# Altium project PowerTower_AdapterUltrazohm.PrjPcb (part 1 of 2)
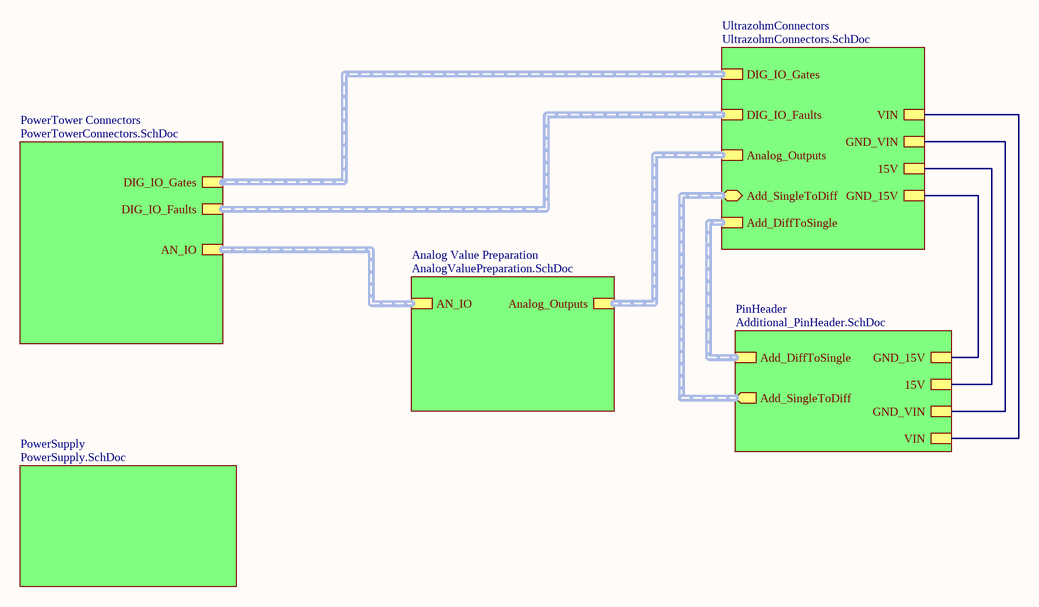
[diagram p0: TopSheet.SchDoc]
8 sheets, 131 parts. Net scope: hierarchical (ports join the sheet entries above them; power ports are global).
Board file: PowerTowerAdapterUltraZohm.PcbDoc
Sheets:
  TopSheet.SchDoc
    PowerTower Connectors = PowerTowerConnectors.SchDoc
    PowerSupply = PowerSupply.SchDoc
    UltrazohmConnectors = UltrazohmConnectors.SchDoc
      Differential to Single = DifferentialToSingle.SchDoc
      Single To RS422 = SingleToDifferential.SchDoc
    Analog Value Preparation = AnalogValuePreparation.SchDoc
    PinHeader = Additional_PinHeader.SchDoc

## Sheet TopSheet.SchDoc
size A4; Author: Timo Wilfling; Address1: TH Nürnberg; Address2: Georg Simon Ohm; Address3: Kesslerplatz 10; Address4: 90489 Nürnberg; SheetNumber: 1; SheetTotal: 8

### Sub-sheets
Analog Value Preparation = AnalogValuePreparation.SchDoc: AN_IO (harness Analog_Connector), Analog_Outputs (harness Analog Outputs)
PinHeader = Additional_PinHeader.SchDoc: Add_SingleToDiff (out, harness Add_SingleToDiff), Add_DiffToSingle (harness Add_DiffToSingle), GND_15V, 15V, GND_VIN, VIN
PowerSupply = PowerSupply.SchDoc: no entries
PowerTower Connectors = PowerTowerConnectors.SchDoc: DIG_IO_Gates (harness DigCon_DIG_IO_Gates), AN_IO (harness Analog_Connector), DIG_IO_Faults (harness DigCon_DIG_IO_Faults)
UltrazohmConnectors = UltrazohmConnectors.SchDoc: DIG_IO_Gates (harness DigCon_DIG_IO_Gates), Analog_Outputs (harness Analog Outputs), DIG_IO_Faults (harness DigCon_DIG_IO_Faults), Add_SingleToDiff (bidir, harness Add_SingleToDiff), VIN, GND_VIN, 15V, GND_15V, Add_DiffToSingle (harness Add_DiffToSingle)

### Nets
NetX8_1: sheet UltrazohmConnectors/VIN, sheet PinHeader/VIN
NetX8_10: sheet UltrazohmConnectors/15V, sheet PinHeader/15V
NetX8_16: sheet UltrazohmConnectors/GND_VIN, sheet PinHeader/GND_VIN
NetX8_25: sheet UltrazohmConnectors/GND_15V, sheet PinHeader/GND_15V

### Buses and harness runs
harness sheet Analog Value Preparation/AN_IO = sheet PowerTower Connectors/AN_IO
harness sheet Analog Value Preparation/Analog_Outputs = sheet UltrazohmConnectors/Analog_Outputs
harness sheet PinHeader/Add_DiffToSingle = sheet UltrazohmConnectors/Add_DiffToSingle
harness sheet PinHeader/Add_SingleToDiff = sheet UltrazohmConnectors/Add_SingleToDiff
harness sheet PowerTower Connectors/DIG_IO_Faults = sheet UltrazohmConnectors/DIG_IO_Faults
harness sheet PowerTower Connectors/DIG_IO_Gates = sheet UltrazohmConnectors/DIG_IO_Gates

### Notes on the sheet
- Title
- Size:
- Date:
- A4
- Revision:
- Time:
- Sheet
- of
- Author:
- Project:

## Sheet PowerTowerConnectors.SchDoc
size A4; Author: Timo Wilfling; Address1: TH Nürnberg; Address2: Georg Simon Ohm; Address3: Kesslerplatz 10; Address4: 90489 Nürnberg; SheetNumber: 3; SheetTotal: 8
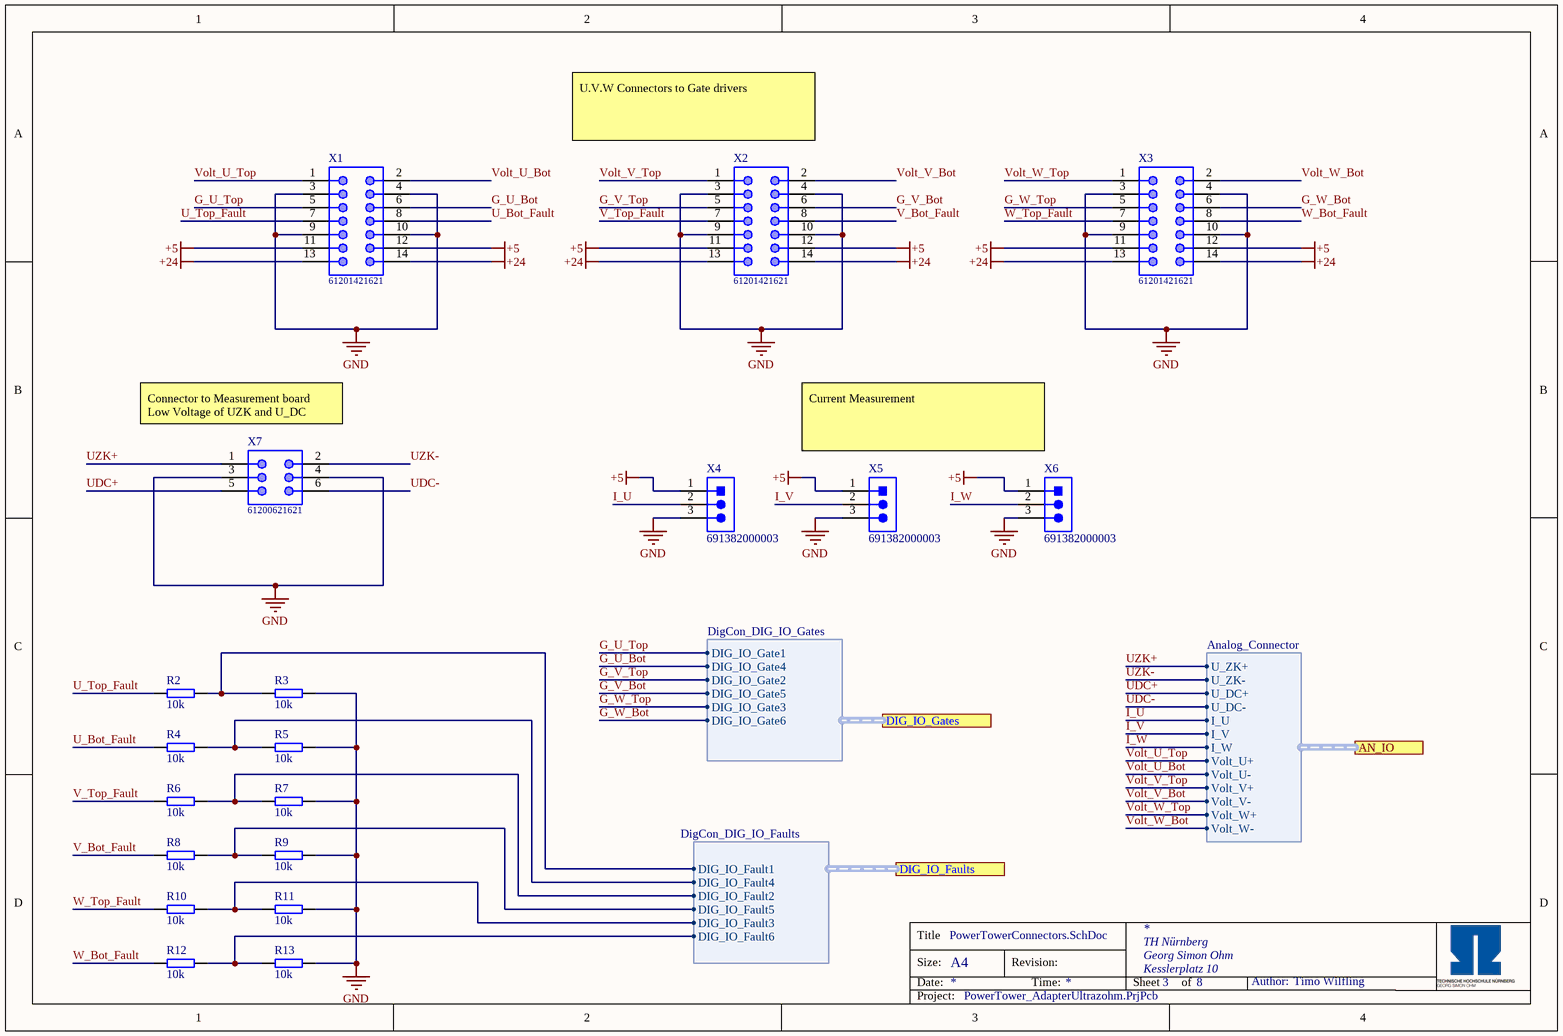
[diagram p1: PowerTowerConnectors.SchDoc]

### Parts
R2  10k  [RES 0603_1608]
R3  10k  [RES 0603_1608]
R4  10k  [RES 0603_1608]
R5  10k  [RES 0603_1608]
R6  10k  [RES 0603_1608]
R7  10k  [RES 0603_1608]
R8  10k  [RES 0603_1608]
R9  10k  [RES 0603_1608]
R10  10k  [RES 0603_1608]
R11  10k  [RES 0603_1608]
R12  10k  [RES 0603_1608]
R13  10k  [RES 0603_1608]
X1  61201421621  [61201421621]
X2  61201421621  [61201421621]
X3  61201421621  [61201421621]
X4  691382000003  [691382000003]
X5  691382000003  [691382000003]
X6  691382000003  [691382000003]
X7  61200621621  [61200621621]

### Ports
AN_IO (harness Analog_Connector), DIG_IO_Faults (harness DigCon_DIG_IO_Faults), DIG_IO_Gates (harness DigCon_DIG_IO_Gates)

### Harnesses
DigCon_DIG_IO_Gates: DIG_IO_Gate1, DIG_IO_Gate4, DIG_IO_Gate2, DIG_IO_Gate5, DIG_IO_Gate3, DIG_IO_Gate6
Analog_Connector: U_ZK+, U_ZK-, U_DC+, U_DC-, I_V, I_U, I_W, Volt_U+, Volt_U-, Volt_V-, Volt_V+, Volt_W+, Volt_W-
DigCon_DIG_IO_Faults: DIG_IO_Fault1, DIG_IO_Fault4, DIG_IO_Fault2, DIG_IO_Fault5, DIG_IO_Fault3, DIG_IO_Fault6

### Nets
+5: X1.11 X1.12 X2.11 X2.12 X3.11 X3.12 X4.1 X5.1 X6.1  [project net 5V]
+24: X1.13 X1.14 X2.13 X2.14 X3.13 X3.14  [project net 24V]
GND: R3.2 R5.2 R7.2 R9.2 R11.2 R13.2 X1.3 X1.4 X1.9 X1.10 X2.3 X2.4 X2.9 X2.10 X3.3 X3.4 X3.9 X3.10 X4.3 X5.3 X6.3 X7.3 X7.4
G_U_Bot: X1.6 ; port DIG_IO_Gates.DIG_IO_Gate4  [project net G4]
G_U_Top: X1.5 ; port DIG_IO_Gates.DIG_IO_Gate1  [project net G1]
G_V_Bot: X2.6 ; port DIG_IO_Gates.DIG_IO_Gate5  [project net G5]
G_V_Top: X2.5 ; port DIG_IO_Gates.DIG_IO_Gate2  [project net G2]
G_W_Bot: X3.6 ; port DIG_IO_Gates.DIG_IO_Gate6  [project net G6]
G_W_Top: X3.5 ; port DIG_IO_Gates.DIG_IO_Gate3  [project net G3]
I_U: X4.2 ; port AN_IO.I_U
I_V: X5.2 ; port AN_IO.I_V
I_W: X6.2 ; port AN_IO.I_W
U_Bot_Fault: R4.1 X1.8
U_Top_Fault: R2.1 X1.7
UDC+: X7.5 ; port AN_IO.U_DC+
UDC-: X7.6 ; port AN_IO.U_DC-
UZK+: X7.1 ; port AN_IO.U_ZK+
UZK-: X7.2 ; port AN_IO.U_ZK-
V_Bot_Fault: R8.1 X2.8
V_Top_Fault: R6.1 X2.7
Volt_U_Bot: X1.2 ; port AN_IO.Volt_U-
Volt_U_Top: X1.1 ; port AN_IO.Volt_U+
Volt_V_Bot: X2.2 ; port AN_IO.Volt_V-
Volt_V_Top: X2.1 ; port AN_IO.Volt_V+
Volt_W_Bot: X3.2 ; port AN_IO.Volt_W-
Volt_W_Top: X3.1 ; port AN_IO.Volt_W+
W_Bot_Fault: R12.1 X3.8
W_Top_Fault: R10.1 X3.7
NetR2_2: R2.2 R3.1 ; port DIG_IO_Faults.DIG_IO_Fault1
NetR4_2: R4.2 R5.1 ; port DIG_IO_Faults.DIG_IO_Fault4
NetR6_2: R6.2 R7.1 ; port DIG_IO_Faults.DIG_IO_Fault2
NetR8_2: R8.2 R9.1 ; port DIG_IO_Faults.DIG_IO_Fault5
NetR10_2: R10.2 R11.1 ; port DIG_IO_Faults.DIG_IO_Fault3
NetR12_2: R12.2 R13.1 ; port DIG_IO_Faults.DIG_IO_Fault6

### Notes on the sheet
- (near X2) U.V.W Connectors to Gate drivers
- (near X7) Connector to Measurement board
  Low Voltage of UZK and U_DC
- Current Measurement
- Title
- Size:
- Date:
- A4
- Revision:
- Time:
- Sheet
- of
- Author:
- Project:

### Library data of the parts
R2-R13 = RK73B1JTTD103J: SMD resistor E24 series; Manufacturer: KOA Speer; Tolerance: 5%; Created from: MGremer; Manufacturer Part Number: RK73B1JTTD103J; PartID: 98; Created On: 14.12.2020 16:17:14; ComponentLink1Description: Datasheet; ComponentLink1URL: https://www.mouser.de/datasheet/2/219/RK73B-1825463.pdf; Component Type: SMD resistor; Device Package: 0603; Last Updated: 02.03.2021 14:07:32; Mounting Type: SMD; Supplier 1: Mouser; Supplier Part Number 1: 660-RK73B1JTTD103J; Type: Resistor; Value: 10k; Live Cycle Status: 1; Stock number: Labor SMD Container
X1-X3 = 61201421621: 2.54mm Double Row 14-pol Vertical Male Pin Box Header; Manufacturer: Wurth; Created from: TWilfling; Number of positions: 14; Manufacturer Part Number: 61201421621; PartID: 45; Created On: 29.04.2021 14:12:30; ComponentLink1Description: Homepage; ComponentLink1URL: https://www.we-online.de/katalog/de/BHD_2_54_MALE_BOX_HEADER_6120XX21621?sq=61201421621#61201421621; ComponentLink2Description: Datasheet; ComponentLink2URL: https://www.we-online.de/katalog/datasheet/61201421621.pdf; Component Type: Wurth Connector; Device Package: Connector; Last Updated: 29.04.2021 14:52:34; Mounting Type: THT; Supplier 1: Wurth; Supplier Part Number 1: 61201421621; Type: Connector; Live Cycle Status: 1; Number of rows: 2; Stock number: not stored
X4-X6 = 691382000003: 2.5mm Single Row 3-pol Vertical PCB Header; Manufacturer: Wurth; Created from: TWilfling; Number of positions: 3; Manufacturer Part Number: 691382000003; PartID: 47; Created On: 29.04.2021 14:24:57; ComponentLink1Description: Homepage; ComponentLink1URL: https://www.we-online.de/katalog/de/TBL_2_50_382_VERTICAL_PCB_HEADER_69138200000X?sq=691382000003#691382000003; ComponentLink2Description: Datasheet; ComponentLink2URL: https://www.we-online.de/katalog/datasheet/691382000003.pdf; Component Type: Wurth Connector; Device Package: Connector; Last Updated: 29.04.2021 14:52:34; Mounting Type: THT; Supplier 1: Wurth; Supplier Part Number 1: 691382000003; Type: Connector; Live Cycle Status: 1; Number of rows: 1; Stock number: not stored
X7 = 61200621621: 2.54mm Double Row 6-pol Vertical Male Pin Box Header; Manufacturer: Wurth; Created from: TWilfling; Number of positions: 6; Manufacturer Part Number: 61200621621; PartID: 44; Created On: 29.04.2021 13:51:54; ComponentLink1Description: Homepage; ComponentLink1URL: https://www.we-online.de/katalog/de/BHD_2_54_MALE_BOX_HEADER_6120XX21621?sq=61200621621#61200621621; ComponentLink2Description: Datasheet; ComponentLink2URL: https://www.we-online.de/katalog/datasheet/61200621621.pdf; Component Type: Wurth Connector; Device Package: Connector; Last Updated: 29.04.2021 14:52:34; Mounting Type: THT; Supplier 1: Wurth; Supplier Part Number 1: 61200621621; Type: Connector; Live Cycle Status: 1; Number of rows: 2; Stock number: not stored

## Sheet PowerSupply.SchDoc
size A4; Author: Timo Wilfling; Address1: TH Nürnberg; Address2: Georg Simon Ohm; Address3: Kesslerplatz 10; Address4: 90489 Nürnberg; SheetNumber: 2; SheetTotal: 8
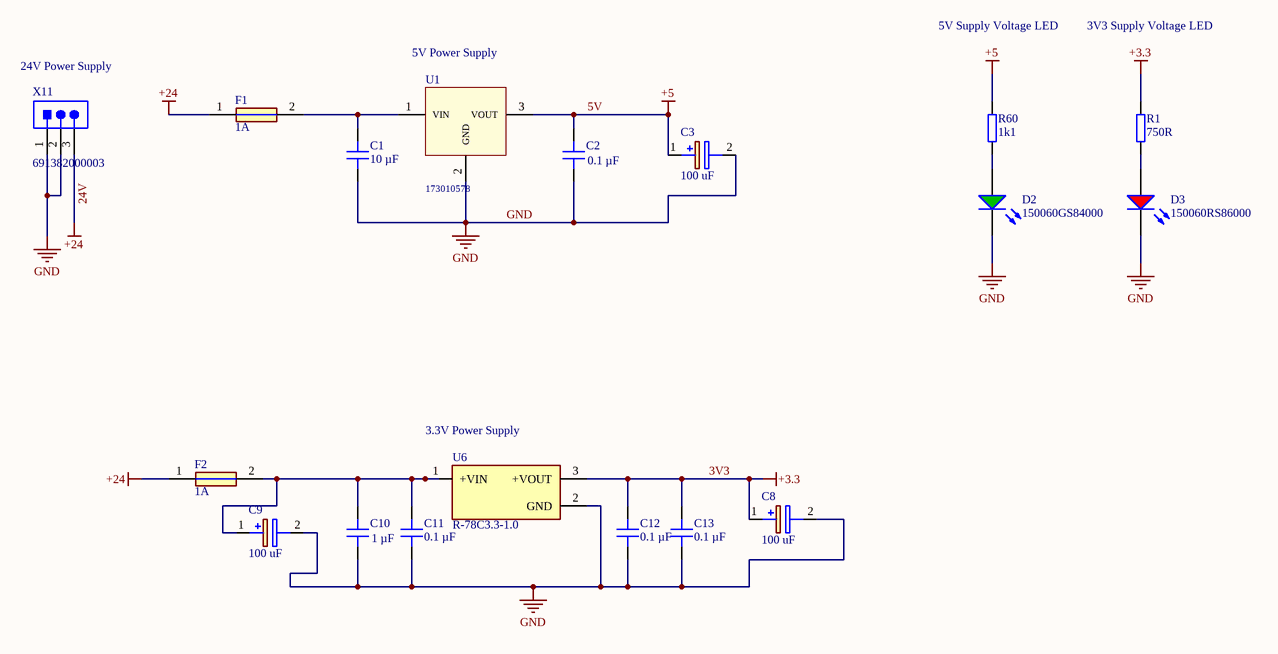
[diagram p2: PowerSupply.SchDoc]

### Parts
C1  10 µF  [C_0805]
C2  0.1 µF  [C_0603]
C3  100 uF  [CAPAE660X610N]
C8  100 uF  [CAPAE1270X1400N]
C9  100 uF  [CAPAE1270X1400N]
C10  1 µF  [C_0603]
C11  0.1 µF  [C_0603]
C12  0.1 µF  [C_0603]
C13  0.1 µF  [C_0603]
D2  150060GS84000  [WL-SMCW_0603]
D3  150060RS86000  [WL-SMCW_0603]
F1  1A  [Littlefuse_154]
F2  1A  [Littlefuse_154]
R1  750R  [RES 0603_1608]
R60  1k1  [RES 0603_1608]
U1  173010578  [FDSM_SIP-3]
U6  R-78C3.3-1.0  [CONV_R-78C3.3-1.0]
X11  691382000003  [691382000003]

### Nets
3V3: C8.1(+) C12.2 C13.2 R1.2 U6.3(+VOUT)  [also labelled +3.3]
5V: C2.2 C3.1(+) R60.2 U1.3(VOUT)  [also labelled +5]
24V: F1.1 F2.1 X11.3  [also labelled +24]
GND: C1.1 C2.1 C3.2(-) C8.2(-) C9.2(-) C10.1 C11.1 C12.1 C13.1 D2.1(K) D3.1(K) U1.2(GND) U6.2(GND) X11.1 X11.2
NetC1_2: C1.2 F1.2 U1.1(VIN)
NetC9_1: C9.1(+) C10.2 C11.2 F2.2 U6.1(+VIN)
NetD2_2: D2.2(A) R60.1
NetD3_2: D3.2(A) R1.1

### Notes on the sheet
- 24V Power Supply
- 5V Power Supply
- 5V Supply Voltage LED
- 3V3 Supply Voltage LED
- (near U6) 3.3V Power Supply
- Title
- Size:
- Date:
- A4
- Revision:
- Time:
- Sheet
- of
- Author:
- Project:

### Library data of the parts
C1 = GRM219R61E106KA12D: Capacitor 0805, 25 VDC, 10 µF, X5R; Manufacturer: muRata; Tolerance: 10 %; Voltage Rating: 25 VDC; Created from: MGremer; Manufacturer Part Number: GRM219R61E106KA12D; PartID: 13; Created On: 20.12.2020 13:54:13; ComponentLink1Description: Datasheet; ComponentLink1URL: https://www.mouser.de/datasheet/2/281/murata_03052018_GRM_Series_1-1310166.pdf; Component Type: Capacitor 0805; Device Package: 0805; Last Updated: 20.12.2020 16:34:30; Mounting Type: SMD; Operating Temperature: -55 - 85°C; Series: GRM; Supplier 1: Mouser; Supplier Part Number 1: 81-GRM219R61E106KA2D; Type: Capacitor; Value: 10 µF; Live Cycle Status: 1; Stock number: Labor SMD Container
C2 = C0603C104J3REC7411: Capacitor 0603, 25 VDC, 0.1 µF, X7R; Manufacturer: KEMET; Tolerance: 5 %; Voltage Rating: 25 VDC; Created from: MGremer; Manufacturer Part Number: C0603C104J3REC7411; PartID: 2; Created On: 20.12.2020 13:54:13; ComponentLink1Description: Datasheet; ComponentLink1URL: https://www.mouser.de/datasheet/2/212/1/KEM_C1090_X7R_ESD-1103328.pdf; Component Type: Capacitor 0603; Device Package: 0603; Last Updated: 20.12.2020 16:43:29; Mounting Type: SMD; Operating Temperature: -55 - 125°C; Series: ESD SMD Auto X7R; Supplier 1: Mouser; Supplier Part Number 1: 80-C0603C104J3RE7411; Type: Capacitor; Value: 0.1 µF; Live Cycle Status: 1; Stock number: Labor SMD Container
C3 = EEE-FK0J101V: Capacitor EEE, 6.3VDC, 100uF; Manufacturer: Panasonic; Tolerance: 20%; Created from: TWilfling; Manufacturer Part Number: EEE-FK0J101V; PartID: 71; Created On: 28.05.2021 17:07:38; ComponentLink1Description: Datasheet; ComponentLink1URL: https://www.mouser.de/datasheet/2/315/ABA0000C1181-947564.pdf; Component Type: Capacitor Al Electrolyt; Device Package: EEE; Last Updated: 28.05.2021 17:48:36; Mounting Type: SMD; Operating Temperature: -55 - 105°C; Series: FK-V; Supplier 1: Mouser; Supplier Part Number 1: 667-EEE-FK0J101V; Type: Capacitor; Voltage Rating: 6.3 VDC; Value: 100 uF; Live Cycle Status: 1; Stock number: not stored
C8 C9 = MAL216099101E3: Capacitor Al Electrolyt, 100 uF, 50VDC; Manufacturer: Vishay; Tolerance: 20%; Created from: TWilfling; Manufacturer Part Number: MAL216099101E3; PartID: 72; Created On: 28.05.2021 17:32:00; ComponentLink1Description: Datasheet; ComponentLink1URL: https://www.mouser.de/datasheet/2/427/160cla-1762101.pdf; Component Type: Capacitor Al Electrolyt; Last Updated: 28.05.2021 17:47:40; Mounting Type: SMD; Operating Temperature: -55 - 150°C; Series: 160 CLA; Supplier 1: Mouser; Supplier Part Number 1: 594-MAL216099101E3; Type: Capacitor; Voltage Rating: 50 VDC; Value: 100 uF; Live Cycle Status: 1; Stock number: not stored
C10 = UMK107AB7105KA-T: Capacitor 0603, 50 VDC, 1 µF, X7R; Manufacturer: Taiyo Yuden; Tolerance: 10 %; Voltage Rating: 50 VDC; Created from: MGremer; Manufacturer Part Number: UMK107AB7105KA-T; PartID: 5; Created On: 20.12.2020 13:54:13; ComponentLink1Description: Datasheet; ComponentLink1URL: https://www.mouser.de/datasheet/2/396/mlcc02_e-1307760.pdf; Component Type: Capacitor 0603; Device Package: 0603; Last Updated: 20.12.2020 16:42:28; Mounting Type: SMD; Operating Temperature: -55 - 125°C; Series: M; Supplier 1: Mouser; Supplier Part Number 1: 963-UMK107AB7105KA-T; Type: Capacitor; Value: 1 µF; Live Cycle Status: 1; Stock number: Labor SMD Container
C11-C13 = C0603X104K5RAC7411: Capacitor 0603, 50 VDC, 0.1 µF, X7R; Manufacturer: KEMET; Tolerance: 10 %; Voltage Rating: 50 VDC; Created from: MGremer; Manufacturer Part Number: C0603X104K5RAC7411; PartID: 3; Created On: 20.12.2020 13:54:13; ComponentLink1Description: Datasheet; ComponentLink1URL: https://www.mouser.de/datasheet/2/212/1/KEM_C1013_X7R_FT_CAP_SMD-1103280.pdf; Component Type: Capacitor 0603; Device Package: 0603; Last Updated: 04.03.2021 09:24:28; Mounting Type: SMD; Operating Temperature: -55 - 125°C; Series: SMD Comm X7R Flex; Supplier 1: Mouser; Supplier Part Number 1: 80-C0603X104K5R7411; Supplier 2: LCSC; Supplier Part Number 2: C14663; Type: Capacitor; Value: 0.1 µF; Live Cycle Status: 1; LCSC Part Number: C14663; Stock number: Labor SMD Container
D2 = 150060GS84000: WL-SMCW SMD Mono-color Chip LED Waterclear Green; Manufacturer: Wuerth Elektronik; Type: Standard; Created from: MGremer; Forward Current I_f: 20 mA; Forward Voltage U_f: 3.2 V; Wavelength: 525 nm; Light Intensity: 3000 mcd; Nominal Power: 78 mW; Manufacturer Part Number: 150060GS84000; PartID: 2; Created On: 08.12.2020 10:41:11; ComponentLink1Description: Datasheet; ComponentLink1URL: https://www.mouser.de/datasheet/2/445/150060GS75020-1714345.pdf; Component Type: LED Diode; Device Package: 0603; Last Updated: 03.03.2021 09:59:51; Mounting Type: SMD; Operating Temperature: -40 - 85 °C; Supplier 1: Mouser; Supplier Part Number 1: 710-150060GS84000; Supplier 2: Farnell; Supplier Part Number 2: 3408612; Supplier 3: Digi-Key; Supplier Part Number 3: 732-150060GS84000CT-ND; Live Cycle Status: 1; Stock number: not stored; Color: green
D3 = 150060RS86000: WL-SMCW SMD Mono-color Chip LED Waterclear Red; Manufacturer: Wuerth Elektronik; Type: Standard; Created from: MGremer; Forward Current I_f: 20 mA; Forward Voltage U_f: 2 V; Wavelength: 624 nm; Light Intensity: 800 mcd; Nominal Power: 48 mW; Manufacturer Part Number: 150060RS86000; PartID: 3; Created On: 08.12.2020 10:48:12; ComponentLink1Description: Datasheet; ComponentLink1URL: https://www.mouser.de/datasheet/2/445/150120RS75000-1714636.pdf; Component Type: LED Diode; Device Package: 0603; Last Updated: 03.03.2021 09:59:52; Mounting Type: SMD; Operating Temperature: -40 - 85 °C; Supplier 1: Mouser; Supplier Part Number 1: 710-150060RS86000; Supplier 2: Farnell; Supplier Part Number 2: 3408608; Supplier 3: Digi-Key; Supplier Part Number 3: 732-150060RS86000CT-ND; Live Cycle Status: 1; Stock number: not stored; Color: red
F1 F2 = 0154001.DR: Duse OMNI BLOK 154; Manufacturer: Littelfuse; Type: Fuse; Nominal voltage AC: 125 VAC; Nominal voltage DC: 125 VDC; Resistance: 78 mOhm; Created from: TWilfling; Manufacturer Part Number: 0154001.DR; PartID: 4; Created On: 07.05.2021 06:50:33; ComponentLink1Description: Datasheet; ComponentLink1URL: https://www.mouser.de/datasheet/2/240/Littelfuse_Fuse_154_154T_154L_154TL_Datasheet_pdf-365375.pdf; Component Type: NAN02 - 154 OMNI-BLOK; Device Package: OMNI-BLOK; Last Updated: 11.05.2021 11:17:19; Mounting Type: SMD; Operating Temperature: -55 - 125 °C; Series: 154; Supplier 1: Mouser; Supplier Part Number 1: 576-0154001.DR; Nominal current: 1 A; Value: 1 A; Live Cycle Status: 1; Stock number: not stored
R1 = RK73B1JTTDD751J: SMD resistor E24 series; Manufacturer: KOA Speer; Tolerance: 5%; Created from: MGremer; Manufacturer Part Number: RK73B1JTTDD751J; PartID: 71; Created On: 14.12.2020 16:17:14; ComponentLink1Description: Datasheet; ComponentLink1URL: https://www.mouser.de/datasheet/2/219/RK73B-1825463.pdf; Component Type: SMD resistor; Device Package: 0603; Last Updated: 02.03.2021 14:07:32; Mounting Type: SMD; Supplier 1: Mouser; Supplier Part Number 1: 660-RK73B1JTTDD751J; Type: Resistor; Value: 750R; Live Cycle Status: 1; Stock number: Labor SMD Container
R60 = RK73B1JTTDD112J: SMD resistor E24 series; Manufacturer: KOA Speer; Tolerance: 5%; Created from: MGremer; Manufacturer Part Number: RK73B1JTTDD112J; PartID: 75; Created On: 14.12.2020 16:17:14; ComponentLink1Description: Datasheet; ComponentLink1URL: https://www.mouser.de/datasheet/2/219/RK73B-1825463.pdf; Component Type: SMD resistor; Device Package: 0603; Last Updated: 02.03.2021 14:07:32; Mounting Type: SMD; Supplier 1: Mouser; Supplier Part Number 1: 660-RK73B1JTTDD112J; Type: Resistor; Value: 1k1; Live Cycle Status: 1; Stock number: Labor SMD Container
U1 = 173010578: Not isolated DCDC Converter 5 V Output, 1 A, 8 - 28 V Input; Manufacturer: Wuerth Elektronik; Value: 5 W; Created from: MGremer; Manufacturer Part Number: 173010578; PartID: 11; Created On: 06.01.2021 09:48:37; ComponentLink1Description: Datasheet; ComponentLink1URL: https://www.mouser.de/datasheet/2/445/173010578-1716125.pdf; Component Type: Not isolated DCDC Converter; Device Package: FDSM; Last Updated: 06.05.2021 06:17:55; Mounting Type: THT; Series: MagI3C-FDSM; Supplier 1: Mouser; Supplier Part Number 1: 710-173010578; Type: not isolated DCDC converter; Live Cycle Status: 1; Stock number: not stored
U6 = R-78C3.3-1.0: Not isolated DCDC Converter 3V3 Output, 1A, 7 - 42V Input; Manufacturer: RECOM; Value: 3V3@1A; Created from: TWilfling; Manufacturer Part Number: R-78C3.3-1.0; PartID: 15; Created On: 10.05.2021 11:04:05; ComponentLink1Description: Datasheet; ComponentLink1URL: https://docs.rs-online.com/9d1a/0900766b8135f258.pdf; Component Type: Not isolated DCDC Convert; Device Package: SIP-3; Last Updated: 11.05.2021 09:24:43; Mounting Type: THT; Operating Temperature: -40 - 85°C; Series: R-78C-1.0; Supplier 1: RS; Supplier Part Number 1: 739-8297; Type: not isolated DCDC converter; Live Cycle Status: 1; Stock number: not stored
X11 = 691382000003: as X4 on sheet PowerTowerConnectors; Manufacturer Part Number: 691382000003; PartID: 47; Created On: 29.04.2021 14:24:57; ComponentLink1Description: Homepage; ComponentLink1URL: https://www.we-online.de/katalog/de/TBL_2_50_382_VERTICAL_PCB_HEADER_69138200000X?sq=691382000003#691382000003; ComponentLink2Description: Datasheet; ComponentLink2URL: https://www.we-online.de/katalog/datasheet/691382000003.pdf; Component Type: Wurth Connector; Device Package: Connector; Last Updated: 29.04.2021 14:52:34; Mounting Type: THT; Supplier 1: Wurth; Supplier Part Number 1: 691382000003; Type: Connector; Live Cycle Status: 1; Number of rows: 1; Stock number: not stored

## Sheet UltrazohmConnectors.SchDoc
size A4; Author: Timo Wilfling; Address1: TH Nürnberg; Address2: Georg Simon Ohm; Address3: Kesslerplatz 10; Address4: 90489 Nürnberg; SheetNumber: 4; SheetTotal: 8
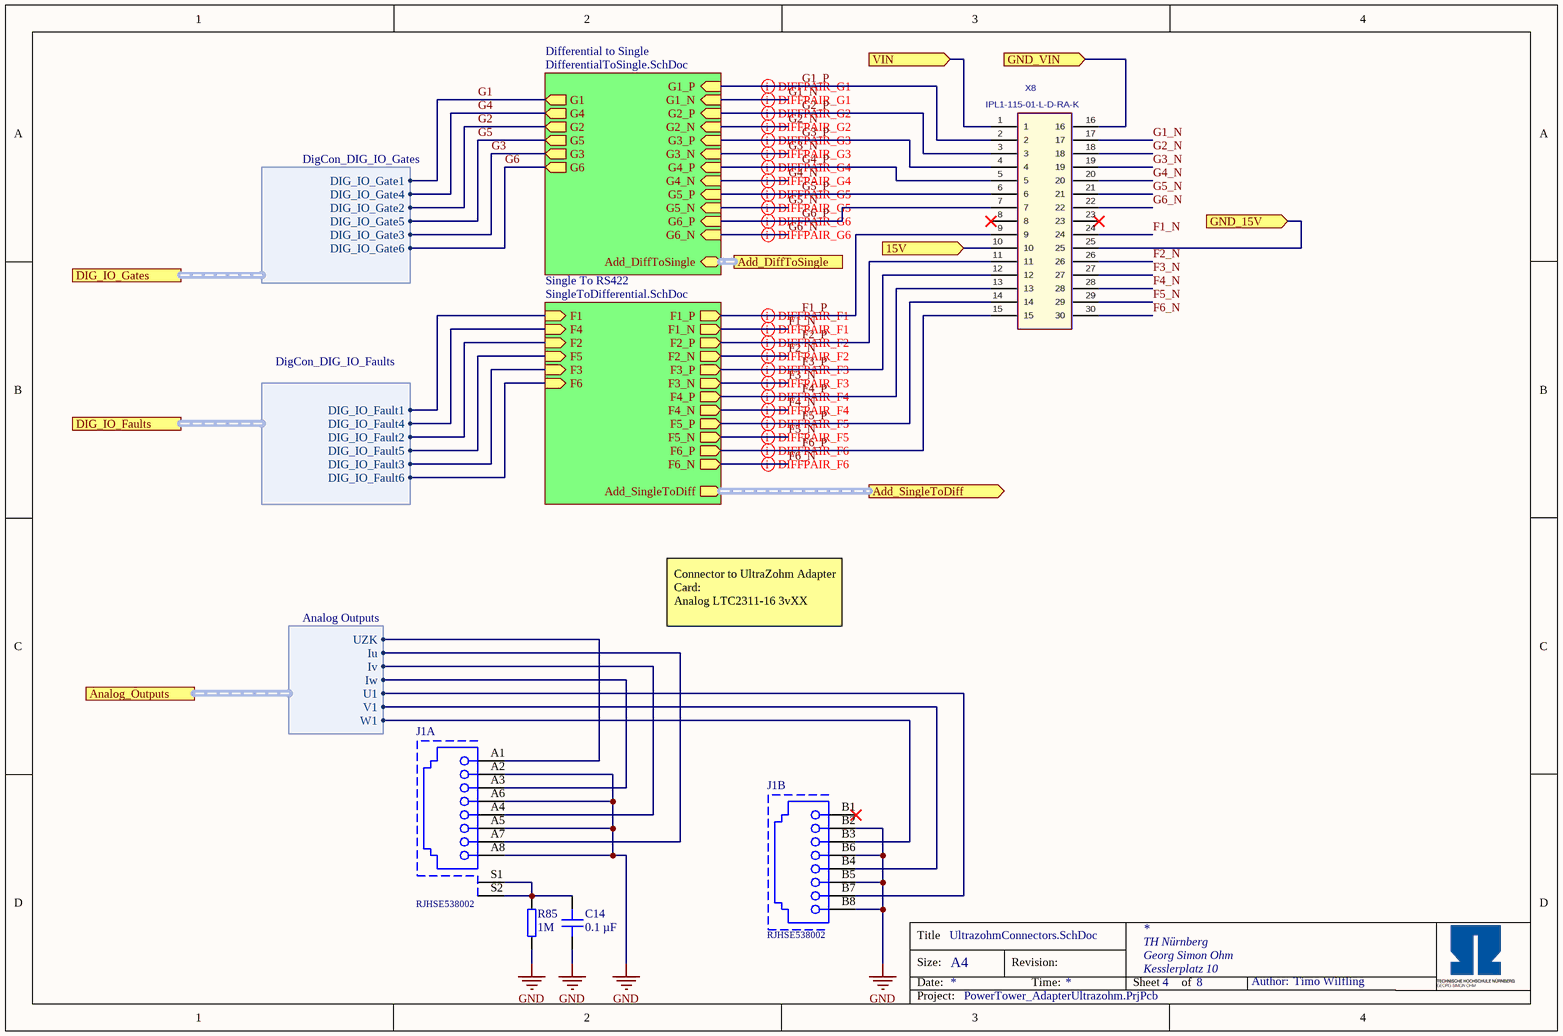
[diagram p3: UltrazohmConnectors.SchDoc]

### Parts
C14  0.1 µF  [C_0805]
J1  RJHSE538002  [RJHSE-5380-02]  (parts A,B of 2)
R85  1M  [RES 0603_1608]
X8  IPL1-115-01-L-D-RA-K  [IPL1-115-01-XX-D-RA]

### Sub-sheets
Differential to Single = DifferentialToSingle.SchDoc: G1 (out), G4 (out), G2 (out), G5 (out), G3 (out), G6 (out), G1_N (in), G2_P (in), G2_N (in), G3_P (in), G3_N (in), G4_P (in), G4_N (in), G1_P (in), G5_P (in), G5_N (in), G6_P (in), G6_N (in), Add_DiffToSingle (bidir, harness Add_DiffToSingle)
Single To RS422 = SingleToDifferential.SchDoc: F1 (in), F4 (in), F2 (in), F5 (in), F3 (in), F6 (in), F1_P (out), F1_N (out), F2_P (out), F2_N (out), F3_P (out), F3_N (out), F4_P (out), F4_N (out), F5_P (out), F5_N (out), F6_P (out), F6_N (out), Add_SingleToDiff (out, harness Add_SingleToDiff)

### Ports
15V (in), Add_DiffToSingle (harness Add_DiffToSingle), Add_SingleToDiff (out, harness Add_SingleToDiff), Analog_Outputs (harness Analog Outputs), DIG_IO_Faults (harness DigCon_DIG_IO_Faults), DIG_IO_Gates (harness DigCon_DIG_IO_Gates), GND_15V (in), GND_VIN (in), VIN (in)

### Harnesses
DigCon_DIG_IO_Gates: DIG_IO_Gate1, DIG_IO_Gate4, DIG_IO_Gate2, DIG_IO_Gate5, DIG_IO_Gate3, DIG_IO_Gate6
Analog Outputs: UZK, Iu, Iv, U1, Iw, V1, W1
DigCon_DIG_IO_Faults: DIG_IO_Fault1, DIG_IO_Fault4, DIG_IO_Fault2, DIG_IO_Fault5, DIG_IO_Fault3, DIG_IO_Fault6

### Nets
GND: C14.1 J1.A2 J1.A5 J1.A6 J1.A8 J1.B2 J1.B5 J1.B6 J1.B8 R85.1
F1_N: X8.24 ; sheet Single To RS422/F1_N
F1_P: X8.9 ; sheet Single To RS422/F1_P
F2_N: X8.26 ; sheet Single To RS422/F2_N
F2_P: X8.11 ; sheet Single To RS422/F2_P
F3_N: X8.27 ; sheet Single To RS422/F3_N
F3_P: X8.12 ; sheet Single To RS422/F3_P
F4_N: X8.28 ; sheet Single To RS422/F4_N
F4_P: X8.13 ; sheet Single To RS422/F4_P
F5_N: X8.29 ; sheet Single To RS422/F5_N
F5_P: X8.14 ; sheet Single To RS422/F5_P
F6_N: X8.30 ; sheet Single To RS422/F6_N
F6_P: X8.15 ; sheet Single To RS422/F6_P
G1: sheet Differential to Single/G1, port DIG_IO_Gates.DIG_IO_Gate1
G1_N: X8.17 ; sheet Differential to Single/G1_N
G1_P: X8.2 ; sheet Differential to Single/G1_P
G2: sheet Differential to Single/G2, port DIG_IO_Gates.DIG_IO_Gate2
G2_N: X8.18 ; sheet Differential to Single/G2_N
G2_P: X8.3 ; sheet Differential to Single/G2_P
G3: sheet Differential to Single/G3, port DIG_IO_Gates.DIG_IO_Gate3
G3_N: X8.19 ; sheet Differential to Single/G3_N
G3_P: X8.4 ; sheet Differential to Single/G3_P
G4: sheet Differential to Single/G4, port DIG_IO_Gates.DIG_IO_Gate4
G4_N: X8.20 ; sheet Differential to Single/G4_N
G4_P: X8.5 ; sheet Differential to Single/G4_P
G5: sheet Differential to Single/G5, port DIG_IO_Gates.DIG_IO_Gate5
G5_N: X8.21 ; sheet Differential to Single/G5_N
G5_P: X8.6 ; sheet Differential to Single/G5_P
G6: sheet Differential to Single/G6, port DIG_IO_Gates.DIG_IO_Gate6
G6_N: X8.22 ; sheet Differential to Single/G6_N
G6_P: X8.7 ; sheet Differential to Single/G6_P
I_U: J1.A7 ; port Analog_Outputs.Iu
I_V: J1.A4 ; port Analog_Outputs.Iv
I_W: J1.A3 ; port Analog_Outputs.Iw
Out_U: J1.B7 ; port Analog_Outputs.U1
Out_UZK: J1.A1 ; port Analog_Outputs.UZK
Out_V: J1.B4 ; port Analog_Outputs.V1
Out_W: J1.B3 ; port Analog_Outputs.W1
NetC14_2: C14.2 J1.S1 J1.S2 R85.2
NetR2_2: sheet Single To RS422/F1, port DIG_IO_Faults.DIG_IO_Fault1
NetR4_2: sheet Single To RS422/F4, port DIG_IO_Faults.DIG_IO_Fault4
NetR6_2: sheet Single To RS422/F2, port DIG_IO_Faults.DIG_IO_Fault2
NetR8_2: sheet Single To RS422/F5, port DIG_IO_Faults.DIG_IO_Fault5
NetR10_2: sheet Single To RS422/F3, port DIG_IO_Faults.DIG_IO_Fault3
NetR12_2: sheet Single To RS422/F6, port DIG_IO_Faults.DIG_IO_Fault6
NetX8_1: X8.1 ; port VIN
NetX8_10: X8.10 ; port 15V
NetX8_16: X8.16 ; port GND_VIN
NetX8_25: X8.25 ; port GND_15V

Not connected (* = marked no-connect by the designer): J1 B1*; X8 8* 23*

### Buses and harness runs
harness port Add_DiffToSingle = sheet Differential to Single/Add_DiffToSingle
harness port Add_SingleToDiff = sheet Single To RS422/Add_SingleToDiff

### Layout directives
differential pair; rule Differential Pairs Routing [Pref Gap = 10mil    Min Gap  = 5mil    Max Gap  = 10milPref Width = 15mil    Min Width  = 3.957mil    Max Width  = 15mil]: G1_P
differential pair: F1_N, F1_P, F2_N, F2_P, F3_N, F3_P, F4_N, F4_P, F5_N, F5_P, F6_N, F6_P, G1_N, G2_N, G2_P, G3_N, G3_P, G4_N, G4_P, G5_N, G5_P, G6_N, G6_P

### Notes on the sheet
- Connector to UltraZohm Adapter Card:
  Analog LTC2311-16 3vXX
- Title
- Size:
- Date:
- A4
- Revision:
- Time:
- Sheet
- of
- Author:
- Project:

### Library data of the parts
C14 = C0805C104J5RECTU: Capacitor 0805, 50 VDC, 0.1 µF, X7R; Manufacturer: KEMET; Tolerance: 5 %; Voltage Rating: 50 VDC; Created from: MGremer; Manufacturer Part Number: C0805C104J5RECTU; PartID: 17; Created On: 20.12.2020 13:54:13; ComponentLink1Description: Datasheet; ComponentLink1URL: https://www.mouser.de/datasheet/2/212/KEM_C1002_X7R_SMD-1102033.pdf; Component Type: Capacitor 0805; Device Package: 0805; Last Updated: 20.12.2020 16:34:30; Mounting Type: SMD; Operating Temperature: -55 - 125°C; Series: SMD Comm X7R; Supplier 1: Mouser; Supplier Part Number 1: 80-C0805C104J5RECTU; Type: Capacitor; Value: 0.1 µF; Live Cycle Status: 1; Stock number: Labor SMD Container
J1 = RJHSE538002: CAT5, RJ45 Connector, 1x2; Manufacturer: Amphenol; Created from: MGremer; Manufacturer Part Number: RJHSE538002; PartID: 4; Created On: 22.02.2021 16:43:38; ComponentLink1Description: Datasheet; ComponentLink1URL: https://www.farnell.com/cad/2360382.pdf; Component Type: RJ45 Connector; Device Package: RJ45; Last Updated: 22.02.2021 16:43:38; Mounting Type: THT; Series: RJHSE; Supplier 1: Farnell; Supplier Part Number 1: 1860605; Type: RJ45 Connector; Live Cycle Status: 1; Stock number: not stored
R85 = RK73B1JTTDD105J: SMD resistor E24 series; Manufacturer: KOA Speer; Tolerance: 5%; Created from: MGremer; Manufacturer Part Number: RK73B1JTTDD105J; PartID: 146; Created On: 14.12.2020 16:17:14; ComponentLink1Description: Datasheet; ComponentLink1URL: https://www.mouser.de/datasheet/2/219/RK73B-1825463.pdf; Component Type: SMD resistor; Device Package: 0603; Last Updated: 02.03.2021 14:07:32; Mounting Type: SMD; Supplier 1: Mouser; Supplier Part Number 1: 660-RK73B1JTTDD105J; Type: Resistor; Value: 1M; Live Cycle Status: 1; Stock number: Labor SMD Container
X8 = IPL1-115-01-L-D-RA-K: Terminal Assembly, Double Row, Right Angle, Thru-Hole, 2.54 mm x 2.54 mm Pitch, 30 Pins; Manufacturer: SAMTEC; Created from: TWendt; Number of positions: 30; Manufacturer Part Number: IPL1-115-01-L-D-RA-K; PartID: 34; Created On: 12.02.2021 15:31:18; ComponentLink1Description: Homepage; ComponentLink1URL: https://www.samtec.com/products/ipl1; Component Type: Samtec Connector; Device Package: Connector; Last Updated: 15.02.2021 10:07:42; Supplier 1: SAMTEC; Supplier Part Number 1: IPL1-115-01-L-D-RA-K; Type: Connector; Live Cycle Status: 1; Number of rows: 2; Stock number: not stored

## Sheet DifferentialToSingle.SchDoc
size A4; Address1: TH Nürnberg; Address2: Georg Simon Ohm; Address3: Kesslerplatz 10; Address4: 90489 Nürnberg; SheetNumber: 5; SheetTotal: 8
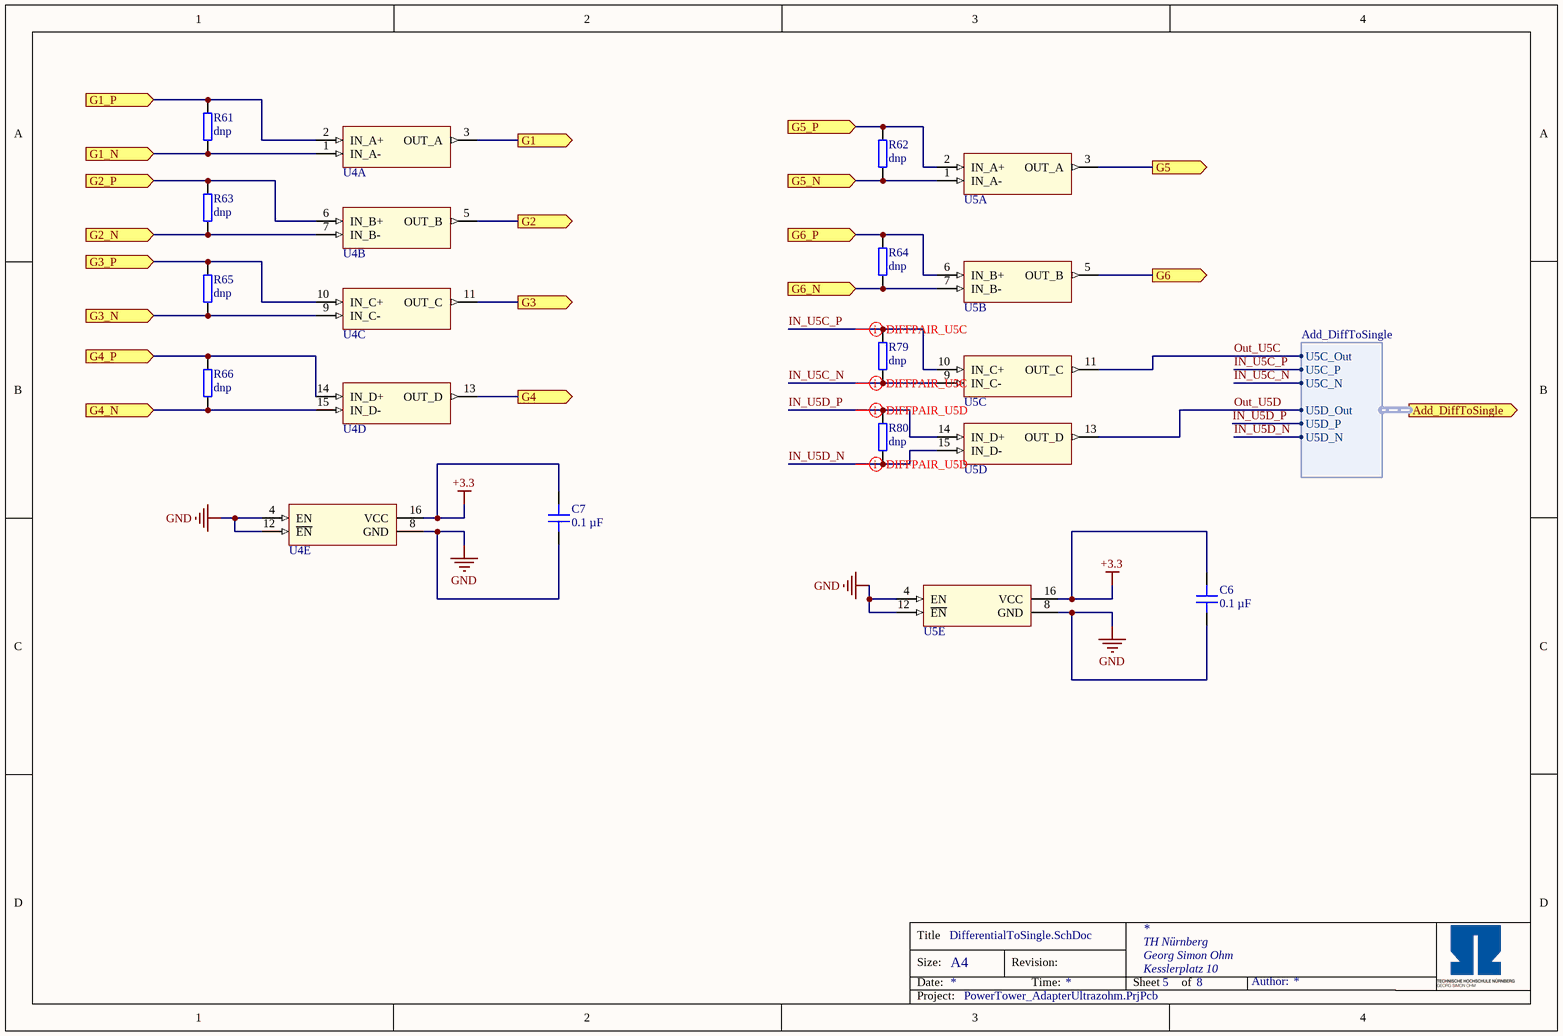
[diagram p4: DifferentialToSingle.SchDoc]

### Parts
C6  0.1 µF  [C_0603]
C7  0.1 µF  [C_0603]
R61  dnp  [RES 0603_1608]
R62  dnp  [RES 0603_1608]
R63  dnp  [RES 0603_1608]
R64  dnp  [RES 0603_1608]
R65  dnp  [RES 0603_1608]
R66  dnp  [RES 0603_1608]
R79  dnp  [RES 0603_1608]
R80  dnp  [RES 0603_1608]
U4  DS26LV32ATM/NOPB  [TI_D-R-PDSO-G16_N]  (value not drawn)  (parts A,B,C,D,E of 5)
U5  DS26LV32ATM/NOPB  [TI_D-R-PDSO-G16_N]  (value not drawn)  (parts A,B,C,D,E of 5)

### Ports
Add_DiffToSingle (out, harness Add_DiffToSingle), G1 (out), G1_N (in), G1_P (in), G2 (out), G2_N (in), G2_P (in), G3 (out), G3_N (in), G3_P (in), G4 (out), G4_N (in), G4_P (in), G5 (out), G5_N (in), G5_P (in), G6 (out), G6_N (in), G6_P (in)

### Harnesses
Add_DiffToSingle: U5C_Out, U5C_P, U5C_N, U5D_Out, U5D_P, U5D_N

### Nets
+3.3: C6.2 C7.2 U4.16(VCC) U5.16(VCC)  [project net 3V3]
GND: C6.1 C7.1 U4.4(EN) U4.8(GND) U4.12(~{EN}) U5.4(EN) U5.8(GND) U5.12(~{EN})
G1: U4.3(OUT_A) ; port G1
G1_N: R61.1 U4.1(IN_A-) ; port G1_N
G1_P: R61.2 U4.2(IN_A+) ; port G1_P
G2: U4.5(OUT_B) ; port G2
G2_N: R63.1 U4.7(IN_B-) ; port G2_N
G2_P: R63.2 U4.6(IN_B+) ; port G2_P
G3: U4.11(OUT_C) ; port G3
G3_N: R65.1 U4.9(IN_C-) ; port G3_N
G3_P: R65.2 U4.10(IN_C+) ; port G3_P
G4: U4.13(OUT_D) ; port G4
G4_N: R66.1 U4.15(IN_D-) ; port G4_N
G4_P: R66.2 U4.14(IN_D+) ; port G4_P
G5: U5.3(OUT_A) ; port G5
G5_N: R62.1 U5.1(IN_A-) ; port G5_N
G5_P: R62.2 U5.2(IN_A+) ; port G5_P
G6: U5.5(OUT_B) ; port G6
G6_N: R64.1 U5.7(IN_B-) ; port G6_N
G6_P: R64.2 U5.6(IN_B+) ; port G6_P
IN_U5C_N: R79.1 U5.9(IN_C-) ; port Add_DiffToSingle.U5C_N
IN_U5C_P: R79.2 U5.10(IN_C+) ; port Add_DiffToSingle.U5C_P
IN_U5D_N: R80.1 U5.15(IN_D-) ; port Add_DiffToSingle.U5D_N
IN_U5D_P: R80.2 U5.14(IN_D+) ; port Add_DiffToSingle.U5D_P
Out_U5C: U5.11(OUT_C) ; port Add_DiffToSingle.U5C_Out
Out_U5D: U5.13(OUT_D) ; port Add_DiffToSingle.U5D_Out

### Layout directives
differential pair: IN_U5C_N, IN_U5C_P, IN_U5D_N, IN_U5D_P

### Notes on the sheet
- Title
- Size:
- Date:
- A4
- Revision:
- Time:
- Sheet
- of
- Author:
- Project:

### Library data of the parts
C6 C7 = C0603X104K5RAC7411: as C11 on sheet PowerSupply; Manufacturer Part Number: C0603X104K5RAC7411; PartID: 3; Created On: 20.12.2020 13:54:13; ComponentLink1Description: Datasheet; ComponentLink1URL: https://www.mouser.de/datasheet/2/212/1/KEM_C1013_X7R_FT_CAP_SMD-1103280.pdf; Component Type: Capacitor 0603; Device Package: 0603; Last Updated: 04.03.2021 09:24:28; Mounting Type: SMD; Operating Temperature: -55 - 125°C; Series: SMD Comm X7R Flex; Supplier 1: Mouser; Supplier Part Number 1: 80-C0603X104K5R7411; Type: Capacitor; Value: 0.1 µF; Live Cycle Status: 1; Stock number: Labor SMD Container; LCSC Part Number: C14663; Supplier 2: LCSC; Supplier Part Number 2: C14663
R61-R66 R79 R80 = -: SMD resistor E24 series; Created from: MGremer; Manufacturer Part Number: -; PartID: 147; Created On: 14.12.2020 16:17:14; ComponentLink1Description: Datasheet; ComponentLink1URL: -; Component Type: SMD resistor; Device Package: 0603; Last Updated: 02.03.2021 14:07:32; Manufacturer: -; Mounting Type: SMD; Supplier 1: -; Supplier Part Number 1: -; Type: Resistor; Tolerance: -; Value: dnp; Live Cycle Status: 1; Stock number: Labor SMD Container
U4 U5 = DS26LV32ATM/NOPB: 3V Enhanced CMOS Quad Differential Line Receiver, 16-pin Narrow SOIC, Pb-Free; Manufacturer: Texas Instruments; Created from: T. Wendt; Manufacturer Part Number: DS26LV32ATM/NOPB; PartID: 2; Created On: 01.03.2021 10:35:45; ComponentLink1Description: Datasheet; ComponentLink1URL: http://www.ti.com/general/docs/lit/getliterature.tsp?genericPartNumber=DS26LV32AT&fileType=pdf; Component Type: RS422 Receiver; Device Package: SOIC; Last Updated: 04.03.2021 09:04:43; Minimum Order: 1; Mounting Type: SMD; Operating Temperature: -40°C - 85°C; Series: DS26LV32; Supplier 1: Mouser; Supplier Part Number 1: 926-DS26LV32ATM/NOPB; Supplier 2: Mouser; Supplier Part Number 2: 926-DS26LV32ATMXNOPB; Supplier 3: LCSC; Supplier Part Number 3: C59861; Type: Standard; Live Cycle Status: 1; Stock number: not stored; LCSC Part Number: C59861

## Sheet SingleToDifferential.SchDoc
size A4; Address1: TH Nürnberg; Address2: Georg Simon Ohm; Address3: Kesslerplatz 10; Address4: 90489 Nürnberg; SheetNumber: 5; SheetTotal: 8
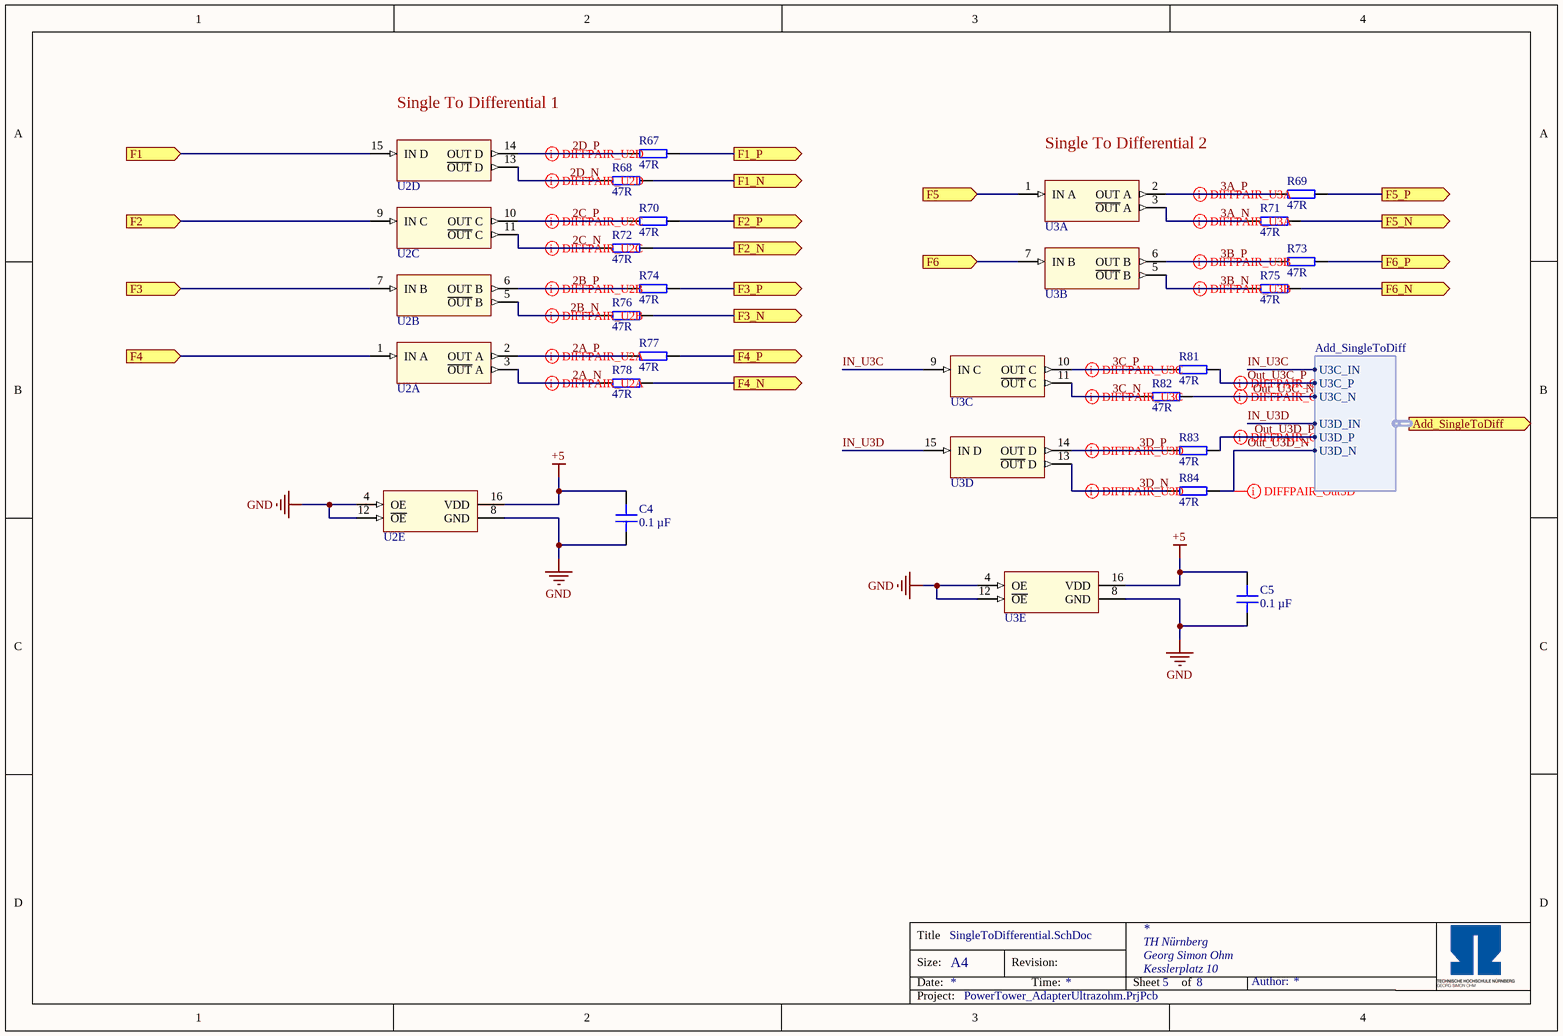
[diagram p5: SingleToDifferential.SchDoc]

### Parts
C4  0.1 µF  [C_0603]
C5  0.1 µF  [C_0603]
R67  47R  [RES 0603_1608]
R68  47R  [RES 0603_1608]
R69  47R  [RES 0603_1608]
R70  47R  [RES 0603_1608]
R71  47R  [RES 0603_1608]
R72  47R  [RES 0603_1608]
R73  47R  [RES 0603_1608]
R74  47R  [RES 0603_1608]
R75  47R  [RES 0603_1608]
R76  47R  [RES 0603_1608]
R77  47R  [RES 0603_1608]
R78  47R  [RES 0603_1608]
R81  47R  [RES 0603_1608]
R82  47R  [RES 0603_1608]
R83  47R  [RES 0603_1608]
R84  47R  [RES 0603_1608]
U2  DS26C31TMX/NOPB  [TI_D-R-PDSO-G16_N]  (value not drawn)  (parts A,B,C,D,E of 5)
U3  DS26C31TMX/NOPB  [TI_D-R-PDSO-G16_N]  (value not drawn)  (parts A,B,C,D,E of 5)

### Ports
Add_SingleToDiff (out, harness Add_SingleToDiff), F1 (in), F1_N (out), F1_P (out), F2 (in), F2_N (out), F2_P (out), F3 (in), F3_N (out), F3_P (out), F4 (in), F4_N (out), F4_P (out), F5 (in), F5_N (out), F5_P (out), F6 (in), F6_N (out), F6_P (out)

### Harnesses
Add_SingleToDiff: U3C_IN, U3C_P, U3C_N, U3D_IN, U3D_P, U3D_N

### Nets
+5: C4.2 C5.2 U2.16(VDD) U3.16(VDD)  [project net 5V]
GND: C4.1 C5.1 U2.4(OE) U2.8(GND) U2.12(~{OE}) U3.4(OE) U3.8(GND) U3.12(~{OE})
2A_N: R78.1 U2.3(~{OUT}_A)
2A_P: R77.1 U2.2(OUT_A)
2B_N: R76.1 U2.5(~{OUT}_B)
2B_P: R74.1 U2.6(OUT_B)
2C_N: R72.1 U2.11(~{OUT}_C)
2C_P: R70.1 U2.10(OUT_C)
2D_N: R68.1 U2.13(~{OUT}_D)
2D_P: R67.1 U2.14(OUT_D)
3A_N: R71.1 U3.3(~{OUT}_A)
3A_P: R69.1 U3.2(OUT_A)
3B_N: R75.1 U3.5(~{OUT}_B)
3B_P: R73.1 U3.6(OUT_B)
3C_N: R82.1 U3.11(~{OUT}_C)
3C_P: R81.1 U3.10(OUT_C)
3D_N: R84.1 U3.13(~{OUT}_D)
3D_P: R83.1 U3.14(OUT_D)
F1_N: R68.2 ; port F1_N
F1_P: R67.2 ; port F1_P
F2_N: R72.2 ; port F2_N
F2_P: R70.2 ; port F2_P
F3_N: R76.2 ; port F3_N
F3_P: R74.2 ; port F3_P
F4_N: R78.2 ; port F4_N
F4_P: R77.2 ; port F4_P
F5_N: R71.2 ; port F5_N
F5_P: R69.2 ; port F5_P
F6_N: R75.2 ; port F6_N
F6_P: R73.2 ; port F6_P
IN_U3C: U3.9(IN_C) ; port Add_SingleToDiff.U3C_IN
IN_U3D: U3.15(IN_D) ; port Add_SingleToDiff.U3D_IN
Out_U3C_N: R82.2 ; port Add_SingleToDiff.U3C_N
Out_U3C_P: R81.2 ; port Add_SingleToDiff.U3C_P
Out_U3D_N: R84.2 ; port Add_SingleToDiff.U3D_N
Out_U3D_P: R83.2 ; port Add_SingleToDiff.U3D_P
NetR2_2: U2.15(IN_D) ; port F1
NetR4_2: U2.1(IN_A) ; port F4
NetR6_2: U2.9(IN_C) ; port F2
NetR8_2: U3.1(IN_A) ; port F5
NetR10_2: U2.7(IN_B) ; port F3
NetR12_2: U3.7(IN_B) ; port F6

### Layout directives
differential pair: 2A_N, 2A_P, 2B_N, 2B_P, 2C_N, 2C_P, 2D_N, 2D_P, 3A_N, 3A_P, 3B_N, 3B_P, 3C_N, 3C_P, 3D_N, 3D_P, Out_U3C_N, Out_U3C_P, Out_U3D_N, Out_U3D_P

### Notes on the sheet
- Single To Differential 1
- Single To Differential 2
- Title
- Size:
- Date:
- A4
- Revision:
- Time:
- Sheet
- of
- Author:
- Project:

### Library data of the parts
C4 C5 = C0603C104J3REC7411: as C2 on sheet PowerSupply; Manufacturer Part Number: C0603C104J3REC7411; PartID: 2; Created On: 20.12.2020 13:54:13; ComponentLink1Description: Datasheet; ComponentLink1URL: https://www.mouser.de/datasheet/2/212/1/KEM_C1090_X7R_ESD-1103328.pdf; Component Type: Capacitor 0603; Device Package: 0603; Last Updated: 20.12.2020 16:43:29; Mounting Type: SMD; Operating Temperature: -55 - 125°C; Series: ESD SMD Auto X7R; Supplier 1: Mouser; Supplier Part Number 1: 80-C0603C104J3RE7411; Type: Capacitor; Value: 0.1 µF; Live Cycle Status: 1; Stock number: Labor SMD Container
R67-R78 R81-R84 = RK73B1JTTDD470J: SMD resistor E24 series; Manufacturer: KOA Speer; Tolerance: 5%; Created from: MGremer; Manufacturer Part Number: RK73B1JTTDD470J; PartID: 42; Created On: 14.12.2020 16:17:14; ComponentLink1Description: Datasheet; ComponentLink1URL: https://www.mouser.de/datasheet/2/219/RK73B-1825463.pdf; Component Type: SMD resistor; Device Package: 0603; Last Updated: 04.03.2021 09:09:42; Mounting Type: SMD; Supplier 1: Mouser; Supplier Part Number 1: 660-RK73B1JTTDD470J; Supplier 2: LCSC; Supplier Part Number 2: C23182; Type: Resistor; Value: 47R; Live Cycle Status: 1; Stock number: Labor SMD Container; LCSC Part Number: C23182
U2 U3 = DS26C31TMX/NOPB: CMOS Quad Tri-State Differential Line Drivers, 16-pin Narrow SOIC, Pb-Free; Manufacturer: Texas Instruments; Created from: T. Wendt; Manufacturer Part Number: DS26C31TMX/NOPB; PartID: 1; Created On: 01.03.2021 10:08:45; ComponentLink1Description: Datasheet; ComponentLink1URL: http://www.ti.com/general/docs/lit/getliterature.tsp?genericPartNumber=DS26C31T&fileType=pdf; Component Type: RS422 Driver; Device Package: SOIC; Last Updated: 04.03.2021 09:04:43; Minimum Order: 1; Mounting Type: SMD; Operating Temperature: -40°C - 85°C; Series: DS26C31; Supplier 1: Digi-Key; Supplier Part Number 1: DS26C31TMX/NOPBCT-ND; Supplier 2: Mouser; Supplier Part Number 2: 926-DS26C31TMX/NOPB; Supplier 3: LCSC; Supplier Part Number 3: C132085; Type: Standard; Live Cycle Status: 1; Stock number: not stored; LCSC Part Number: C132085

## Sheet AnalogValuePreparation.SchDoc
size A4; Address1: TH Nürnberg; Address2: Georg Simon Ohm; Address3: Kesslerplatz 10; Address4: 90489 Nürnberg; SheetNumber: 7; SheetTotal: 8
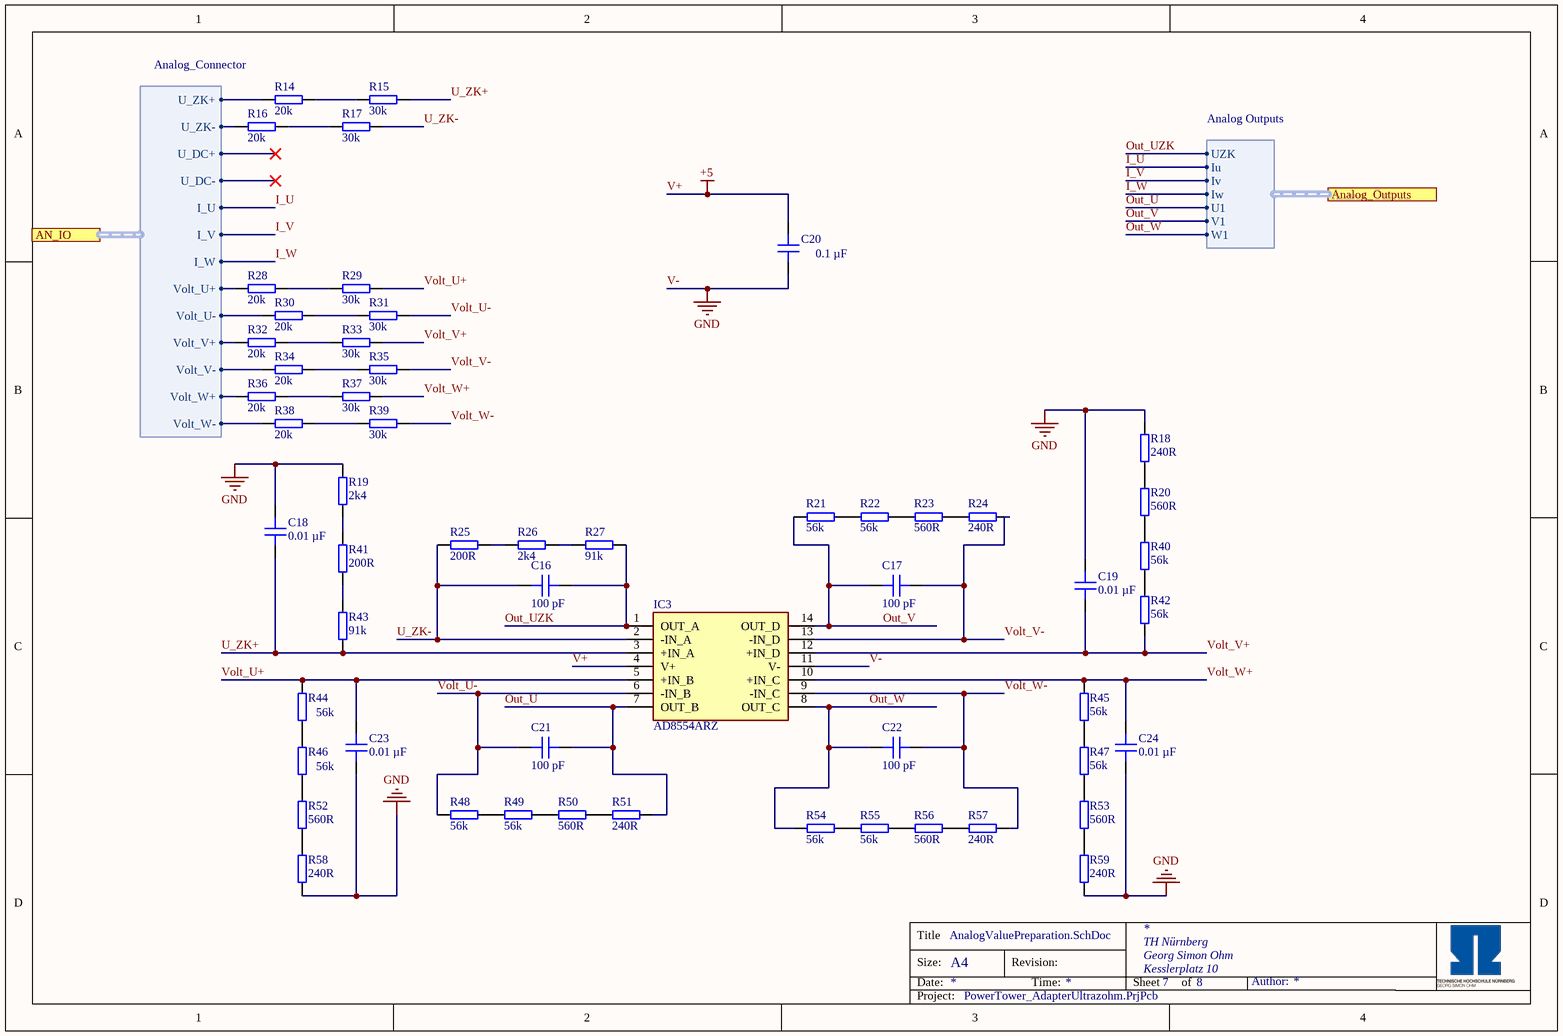
[diagram p6: AnalogValuePreparation.SchDoc]

### Parts
C16  100 pF  [C_0603]
C17  100 pF  [C_0603]
C18  0.01 µF  [C_0603]
C19  0.01 µF  [C_0603]
C20  0.1 µF  [C_0603]
C21  100 pF  [C_0603]
C22  100 pF  [C_0603]
C23  0.01 µF  [C_0603]
C24  0.01 µF  [C_0603]
IC3  AD8554ARZ  [SOIC127P600X175-14N]
R14  20k  [RES 0603_1608]
R15  30k  [RES 0603_1608]
R16  20k  [RES 0603_1608]
R17  30k  [RES 0603_1608]
R18  240R  [RES 0603_1608]
R19  2k4  [RES 0603_1608]
R20  560R  [RES 0603_1608]
R21  56k  [RES 0603_1608]
R22  56k  [RES 0603_1608]
R23  560R  [RES 0603_1608]
R24  240R  [RES 0603_1608]
R25  200R  [RES 0603_1608]
R26  2k4  [RES 0603_1608]
R27  91k  [RES 0603_1608]
R28  20k  [RES 0603_1608]
R29  30k  [RES 0603_1608]
R30  20k  [RES 0603_1608]
R31  30k  [RES 0603_1608]
R32  20k  [RES 0603_1608]
R33  30k  [RES 0603_1608]
R34  20k  [RES 0603_1608]
R35  30k  [RES 0603_1608]
R36  20k  [RES 0603_1608]
R37  30k  [RES 0603_1608]
R38  20k  [RES 0603_1608]
R39  30k  [RES 0603_1608]
R40  56k  [RES 0603_1608]
R41  200R  [RES 0603_1608]
R42  56k  [RES 0603_1608]
R43  91k  [RES 0603_1608]
R44  56k  [RES 0603_1608]
R45  56k  [RES 0603_1608]
R46  56k  [RES 0603_1608]
R47  56k  [RES 0603_1608]
R48  56k  [RES 0603_1608]
R49  56k  [RES 0603_1608]
R50  560R  [RES 0603_1608]
R51  240R  [RES 0603_1608]
R52  560R  [RES 0603_1608]
R53  560R  [RES 0603_1608]
R54  56k  [RES 0603_1608]
R55  56k  [RES 0603_1608]
R56  560R  [RES 0603_1608]
R57  240R  [RES 0603_1608]
R58  240R  [RES 0603_1608]
R59  240R  [RES 0603_1608]

### Ports
AN_IO (harness Analog_Connector), Analog_Outputs (harness Analog Outputs)

### Harnesses
Analog_Connector: U_ZK+, U_ZK-, U_DC+, U_DC-, I_V, I_U, I_W, Volt_U+, Volt_U-, Volt_V-, Volt_V+, Volt_W+, Volt_W-
Analog Outputs: UZK, Iu, Iw, Iv, U1, W1, V1

### Nets
+5: C20.2 IC3.4(V+)  [also labelled V+]  [project net 5V]
GND: C18.2 C19.2 C20.1 C23.2 C24.2 IC3.11(V-) R18.2 R19.2 R58.2 R59.2  [also labelled V-]
I_U: port AN_IO.I_U, port Analog_Outputs.Iu
I_V: port AN_IO.I_V, port Analog_Outputs.Iv
I_W: port AN_IO.I_W, port Analog_Outputs.Iw
Out_U: C21.1 IC3.7(OUT_B) R51.2 ; port Analog_Outputs.U1
Out_UZK: C16.2 IC3.1(OUT_A) R27.2 ; port Analog_Outputs.UZK
Out_V: C17.1 IC3.14(OUT_D) R21.1 ; port Analog_Outputs.V1
Out_W: C22.2 IC3.8(OUT_C) R54.1 ; port Analog_Outputs.W1
U_ZK+: C18.1 IC3.3(+IN_A) R15.2 R43.1
U_ZK-: C16.1 IC3.2(-IN_A) R17.2 R25.1
UZK+: R14.1 ; port AN_IO.U_ZK+
UZK-: R16.1 ; port AN_IO.U_ZK-
Volt_U+: C23.1 IC3.5(+IN_B) R29.2 R44.1
Volt_U-: C21.2 IC3.6(-IN_B) R31.2 R48.1
Volt_U_Bot: R30.1 ; port AN_IO.Volt_U-
Volt_U_Top: R28.1 ; port AN_IO.Volt_U+
Volt_V+: C19.1 IC3.12(+IN_D) R33.2 R42.1
Volt_V-: C17.2 IC3.13(-IN_D) R24.2 R35.2
Volt_V_Bot: R34.1 ; port AN_IO.Volt_V-
Volt_V_Top: R32.1 ; port AN_IO.Volt_V+
Volt_W+: C24.1 IC3.10(+IN_C) R37.2 R45.1
Volt_W-: C22.1 IC3.9(-IN_C) R39.2 R57.2
Volt_W_Bot: R38.1 ; port AN_IO.Volt_W-
Volt_W_Top: R36.1 ; port AN_IO.Volt_W+
NetR14_2: R14.2 R15.1
NetR16_2: R16.2 R17.1
NetR18_1: R18.1 R20.2
NetR19_1: R19.1 R41.2
NetR20_1: R20.1 R40.2
NetR21_2: R21.2 R22.1
NetR22_2: R22.2 R23.1
NetR23_2: R23.2 R24.1
NetR25_2: R25.2 R26.1
NetR26_2: R26.2 R27.1
NetR28_2: R28.2 R29.1
NetR30_2: R30.2 R31.1
NetR32_2: R32.2 R33.1
NetR34_2: R34.2 R35.1
NetR36_2: R36.2 R37.1
NetR38_2: R38.2 R39.1
NetR40_1: R40.1 R42.2
NetR41_1: R41.1 R43.2
NetR44_2: R44.2 R46.1
NetR45_2: R45.2 R47.1
NetR46_2: R46.2 R52.1
NetR47_2: R47.2 R53.1
NetR48_2: R48.2 R49.1
NetR49_2: R49.2 R50.1
NetR50_2: R50.2 R51.1
NetR52_2: R52.2 R58.1
NetR53_2: R53.2 R59.1
NetR54_2: R54.2 R55.1
NetR55_2: R55.2 R56.1
NetR56_2: R56.2 R57.1

### Notes on the sheet
- Title
- Size:
- Date:
- A4
- Revision:
- Time:
- Sheet
- of
- Author:
- Project:

### Library data of the parts
C16 C17 C21 C22 = 885012006057: Capacitor 0603, 50 VDC, 100 pF, C0G; Manufacturer: Wuerth Elektronik; Tolerance: 5 %; Voltage Rating: 50 VDC; Created from: MGremer; Manufacturer Part Number: 885012006057; PartID: 44; Created On: 20.12.2020 13:54:13; ComponentLink1Description: Datasheet; ComponentLink1URL: https://www.mouser.de/datasheet/2/445/885012006057-1727261.pdf; Component Type: Capacitor 0603; Device Package: 0603; Last Updated: 20.12.2020 16:24:16; Mounting Type: SMD; Operating Temperature: -55 - 125°C; Series: WCAP-CSGP; Supplier 1: Mouser; Supplier Part Number 1: 710-885012006057; Type: Capacitor; Value: 100 pF; Live Cycle Status: 1; Stock number: not stored
C18 C19 C23 C24 = GCJ188R71H103KA01D: Capacitor 0603, 50 VDC, 0.01 µF, X7R; Manufacturer: muRata; Tolerance: 10 %; Voltage Rating: 50 VDC; Created from: MGremer; Manufacturer Part Number: GCJ188R71H103KA01D; PartID: 1; Created On: 20.12.2020 13:54:13; ComponentLink1Description: Datasheet; ComponentLink1URL: https://www.mouser.de/datasheet/2/281/c03e-516224.pdf; Component Type: Capacitor 0603; Device Package: 0603; Last Updated: 20.12.2020 16:24:16; Mounting Type: SMD; Operating Temperature: -55 - 125°C; Series: GCJ; Supplier 1: Mouser; Supplier Part Number 1: 81-GCJ188R71H103KA1D; Type: Capacitor; Value: 0.01 µF; Live Cycle Status: 1; Stock number: Labor SMD Container
C20 = C0603X104K5RAC7411: as C11 on sheet PowerSupply; Manufacturer Part Number: C0603X104K5RAC7411; PartID: 3; Created On: 20.12.2020 13:54:13; ComponentLink1Description: Datasheet; ComponentLink1URL: https://www.mouser.de/datasheet/2/212/1/KEM_C1013_X7R_FT_CAP_SMD-1103280.pdf; Component Type: Capacitor 0603; Device Package: 0603; Last Updated: 04.03.2021 09:24:28; Mounting Type: SMD; Operating Temperature: -55 - 125°C; Series: SMD Comm X7R Flex; Supplier 1: Mouser; Supplier Part Number 1: 80-C0603X104K5R7411; Supplier 2: LCSC; Supplier Part Number 2: C14663; Type: Capacitor; Value: 0.1 µF; Live Cycle Status: 1; LCSC Part Number: C14663; Stock number: Labor SMD Container
IC3 = AD8554ARZ: Differential Amplifier, 3V 1.5MHz, 145dB; Manufacturer: Analog Devices; Channels: 4; Value: Rail-to-Rail; Created from: TWilfling; Manufacturer Part Number: AD8554ARZ; PartID: 5; Created On: 07.05.2021 08:10:59; ComponentLink1Description: Datasheet; ComponentLink1URL: https://docs.rs-online.com/3587/0900766b814b3148.pdf; ComponentLink2Description: [NULL]; ComponentLink2URL: [NULL]; Component Type: Differential Amplifier; Device Package: SOIC-14; Last Updated: 07.05.2021 08:11:15; Mounting Type: SMD; Operating Temperature: -40 - 125°C; Supplier 1: RS; Supplier Part Number 1: 412-995; Type: Differential Amplifier; GBP: 1.5 MHz; CMRR: 145 dB; Live Cycle Status: 1; Stock number: not stored
R14 R16 R28 R30 R32 R34 R36 R38 = RK73B1JTTD203J: SMD resistor E24 series; Manufacturer: KOA Speer; Tolerance: 5%; Created from: MGremer; Manufacturer Part Number: RK73B1JTTD203J; PartID: 105; Created On: 14.12.2020 16:17:14; ComponentLink1Description: Datasheet; ComponentLink1URL: https://www.mouser.de/datasheet/2/219/RK73B-1825463.pdf; Component Type: SMD resistor; Device Package: 0603; Last Updated: 02.03.2021 14:07:32; Mounting Type: SMD; Supplier 1: Mouser; Supplier Part Number 1: 660-RK73B1JTTD203J; Type: Resistor; Value: 20k; Live Cycle Status: 1; Stock number: Labor SMD Container
R15 R17 R29 R31 R33 R35 R37 R39 = RK73B1JTTD303J: SMD resistor E24 series; Manufacturer: KOA Speer; Tolerance: 5%; Created from: MGremer; Manufacturer Part Number: RK73B1JTTD303J; PartID: 109; Created On: 14.12.2020 16:17:14; ComponentLink1Description: Datasheet; ComponentLink1URL: https://www.mouser.de/datasheet/2/219/RK73B-1825463.pdf; Component Type: SMD resistor; Device Package: 0603; Last Updated: 02.03.2021 14:07:32; Mounting Type: SMD; Supplier 1: Mouser; Supplier Part Number 1: 660-RK73B1JTTD303J; Type: Resistor; Value: 30k; Live Cycle Status: 1; Stock number: Labor SMD Container
R18 R24 R51 R57-R59 = RK73B1JTTDD241J: SMD resistor E24 series; Manufacturer: KOA Speer; Tolerance: 5%; Created from: MGremer; Manufacturer Part Number: RK73B1JTTDD241J; PartID: 59; Created On: 14.12.2020 16:17:14; ComponentLink1Description: Datasheet; ComponentLink1URL: https://www.mouser.de/datasheet/2/219/RK73B-1825463.pdf; Component Type: SMD resistor; Device Package: 0603; Last Updated: 02.03.2021 14:07:32; Mounting Type: SMD; Supplier 1: Mouser; Supplier Part Number 1: 660-RK73B1JTTDD241J; Type: Resistor; Value: 240R; Live Cycle Status: 1; Stock number: Labor SMD Container
R19 R26 = RK73B1JTTDD242J: SMD resistor E24 series; Manufacturer: KOA Speer; Tolerance: 5%; Created from: MGremer; Manufacturer Part Number: RK73B1JTTDD242J; PartID: 83; Created On: 14.12.2020 16:17:14; ComponentLink1Description: Datasheet; ComponentLink1URL: https://www.mouser.de/datasheet/2/219/RK73B-1825463.pdf; Component Type: SMD resistor; Device Package: 0603; Last Updated: 02.03.2021 14:07:32; Mounting Type: SMD; Supplier 1: Mouser; Supplier Part Number 1: 660-RK73B1JTTDD242J; Type: Resistor; Value: 2k4; Live Cycle Status: 1; Stock number: Labor SMD Container
R20 R23 R50 R52 R53 R56 = RK73B1JTTD561J: SMD resistor E24 series; Manufacturer: KOA Speer; Tolerance: 5%; Created from: MGremer; Manufacturer Part Number: RK73B1JTTD561J; PartID: 68; Created On: 14.12.2020 16:17:14; ComponentLink1Description: Datasheet; ComponentLink1URL: https://www.mouser.de/datasheet/2/219/RK73B-1825463.pdf; Component Type: SMD resistor; Device Package: 0603; Last Updated: 02.03.2021 14:07:32; Mounting Type: SMD; Supplier 1: Mouser; Supplier Part Number 1: 660-RK73B1JTTD561J; Type: Resistor; Value: 560R; Live Cycle Status: 1; Stock number: Labor SMD Container
R21 R22 R40 R42 R44-R49 R54 R55 = RK73B1JTTDD563J: SMD resistor E24 series; Manufacturer: KOA Speer; Tolerance: 5%; Created from: MGremer; Manufacturer Part Number: RK73B1JTTDD563J; PartID: 116; Created On: 14.12.2020 16:17:14; ComponentLink1Description: Datasheet; ComponentLink1URL: https://www.mouser.de/datasheet/2/219/RK73B-1825463.pdf; Component Type: SMD resistor; Device Package: 0603; Last Updated: 02.03.2021 14:07:32; Mounting Type: SMD; Supplier 1: Mouser; Supplier Part Number 1: 660-RK73B1JTTDD563J; Type: Resistor; Value: 56k; Live Cycle Status: 1; Stock number: Labor SMD Container
R25 R41 = RK73B1JTTD201J: SMD resistor E24 series; Manufacturer: KOA Speer; Tolerance: 5%; Created from: MGremer; Manufacturer Part Number: RK73B1JTTD201J; PartID: 57; Created On: 14.12.2020 16:17:14; ComponentLink1Description: Datasheet; ComponentLink1URL: https://www.mouser.de/datasheet/2/219/RK73B-1825463.pdf; Component Type: SMD resistor; Device Package: 0603; Last Updated: 02.03.2021 14:07:32; Mounting Type: SMD; Supplier 1: Mouser; Supplier Part Number 1: 660-RK73B1JTTD201J; Type: Resistor; Value: 200R; Live Cycle Status: 1; Stock number: Labor SMD Container
R27 R43 = RK73B1JTTDD913J: SMD resistor E24 series; Manufacturer: KOA Speer; Tolerance: 5%; Created from: MGremer; Manufacturer Part Number: RK73B1JTTDD913J; PartID: 121; Created On: 14.12.2020 16:17:14; ComponentLink1Description: Datasheet; ComponentLink1URL: https://www.mouser.de/datasheet/2/219/RK73B-1825463.pdf; Component Type: SMD resistor; Device Package: 0603; Last Updated: 02.03.2021 14:07:32; Mounting Type: SMD; Supplier 1: Mouser; Supplier Part Number 1: 660-RK73B1JTTDD913J; Type: Resistor; Value: 91k; Live Cycle Status: 1; Stock number: Labor SMD Container

## Sheet Additional_PinHeader.SchDoc
size A4; Author: Timo Wilfling; Address1: TH Nürnberg; Address2: Georg Simon Ohm; Address3: Kesslerplatz 10; Address4: 90489 Nürnberg; SheetNumber: 8; SheetTotal: 8
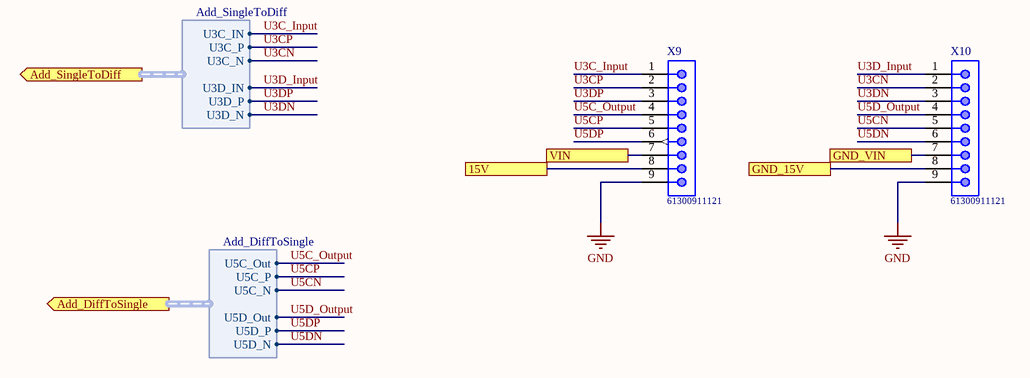
[diagram p7: Additional_PinHeader.SchDoc]

### Parts
X9  61300911121  [61300911121]
X10  61300911121  [61300911121]

### Ports
15V, Add_DiffToSingle (out, harness Add_DiffToSingle), Add_SingleToDiff (out, harness Add_SingleToDiff), GND_15V, GND_VIN, VIN

### Harnesses
Add_SingleToDiff: U3C_IN, U3C_P, U3C_N, U3D_IN, U3D_P, U3D_N
Add_DiffToSingle: U5C_Out, U5C_P, U5C_N, U5D_Out, U5D_P, U5D_N

### Nets
GND: X9.9 X10.9
U3C_Input: X9.1 ; port Add_SingleToDiff.U3C_IN  [project net IN_U3C]
U3CN: X10.2 ; port Add_SingleToDiff.U3C_N  [project net Out_U3C_N]
U3CP: X9.2 ; port Add_SingleToDiff.U3C_P  [project net Out_U3C_P]
U3D_Input: X10.1 ; port Add_SingleToDiff.U3D_IN  [project net IN_U3D]
U3DN: X10.3 ; port Add_SingleToDiff.U3D_N  [project net Out_U3D_N]
U3DP: X9.3 ; port Add_SingleToDiff.U3D_P  [project net Out_U3D_P]
U5C_Output: X9.4 ; port Add_DiffToSingle.U5C_Out  [project net Out_U5C]
U5CN: X10.5 ; port Add_DiffToSingle.U5C_N  [project net IN_U5C_N]
U5CP: X9.5 ; port Add_DiffToSingle.U5C_P  [project net IN_U5C_P]
U5D_Output: X10.4 ; port Add_DiffToSingle.U5D_Out  [project net Out_U5D]
U5DN: X10.6 ; port Add_DiffToSingle.U5D_N  [project net IN_U5D_N]
U5DP: X9.6 ; port Add_DiffToSingle.U5D_P  [project net IN_U5D_P]
NetX8_1: X9.7 ; port VIN
NetX8_10: X9.8 ; port 15V
NetX8_16: X10.7 ; port GND_VIN
NetX8_25: X10.8 ; port GND_15V

### Notes on the sheet
- Title
- Size:
- Date:
- A4
- Revision:
- Time:
- Sheet
- of
- Author:
- Project:

### Library data of the parts
X9 X10 = 61300911121: Pin Header, 2.54mm, 9 Pins, Single Row; Manufacturer: WURTH; Created from: TWilfling; Number of positions: 9; Manufacturer Part Number: 61300911121; PartID: 4; Created On: 18.05.2021 08:47:30; ComponentLink1Description: Datasheet; ComponentLink1URL: https://www.we-online.com/catalog/datasheet/61300211121.pdf; ComponentLink2Description: Homepage; ComponentLink2URL: https://www.we-online.com/catalog/en/PHD_2_54_THT_PIN_HEADER_6130XX11121; Component Type: Pin Header; Device Package: THT; Last Updated: 18.05.2021 14:06:54; Mounting Type: THT; Supplier 1: Wurth Electronik; Supplier Part Number 1: 61300911121; Type: Pin Header THT; Live Cycle Status: 1; Stock number: not stored; Number of rows: 1